# EAGLE design IoT_pro_01 (EAGLE 7.1.0)
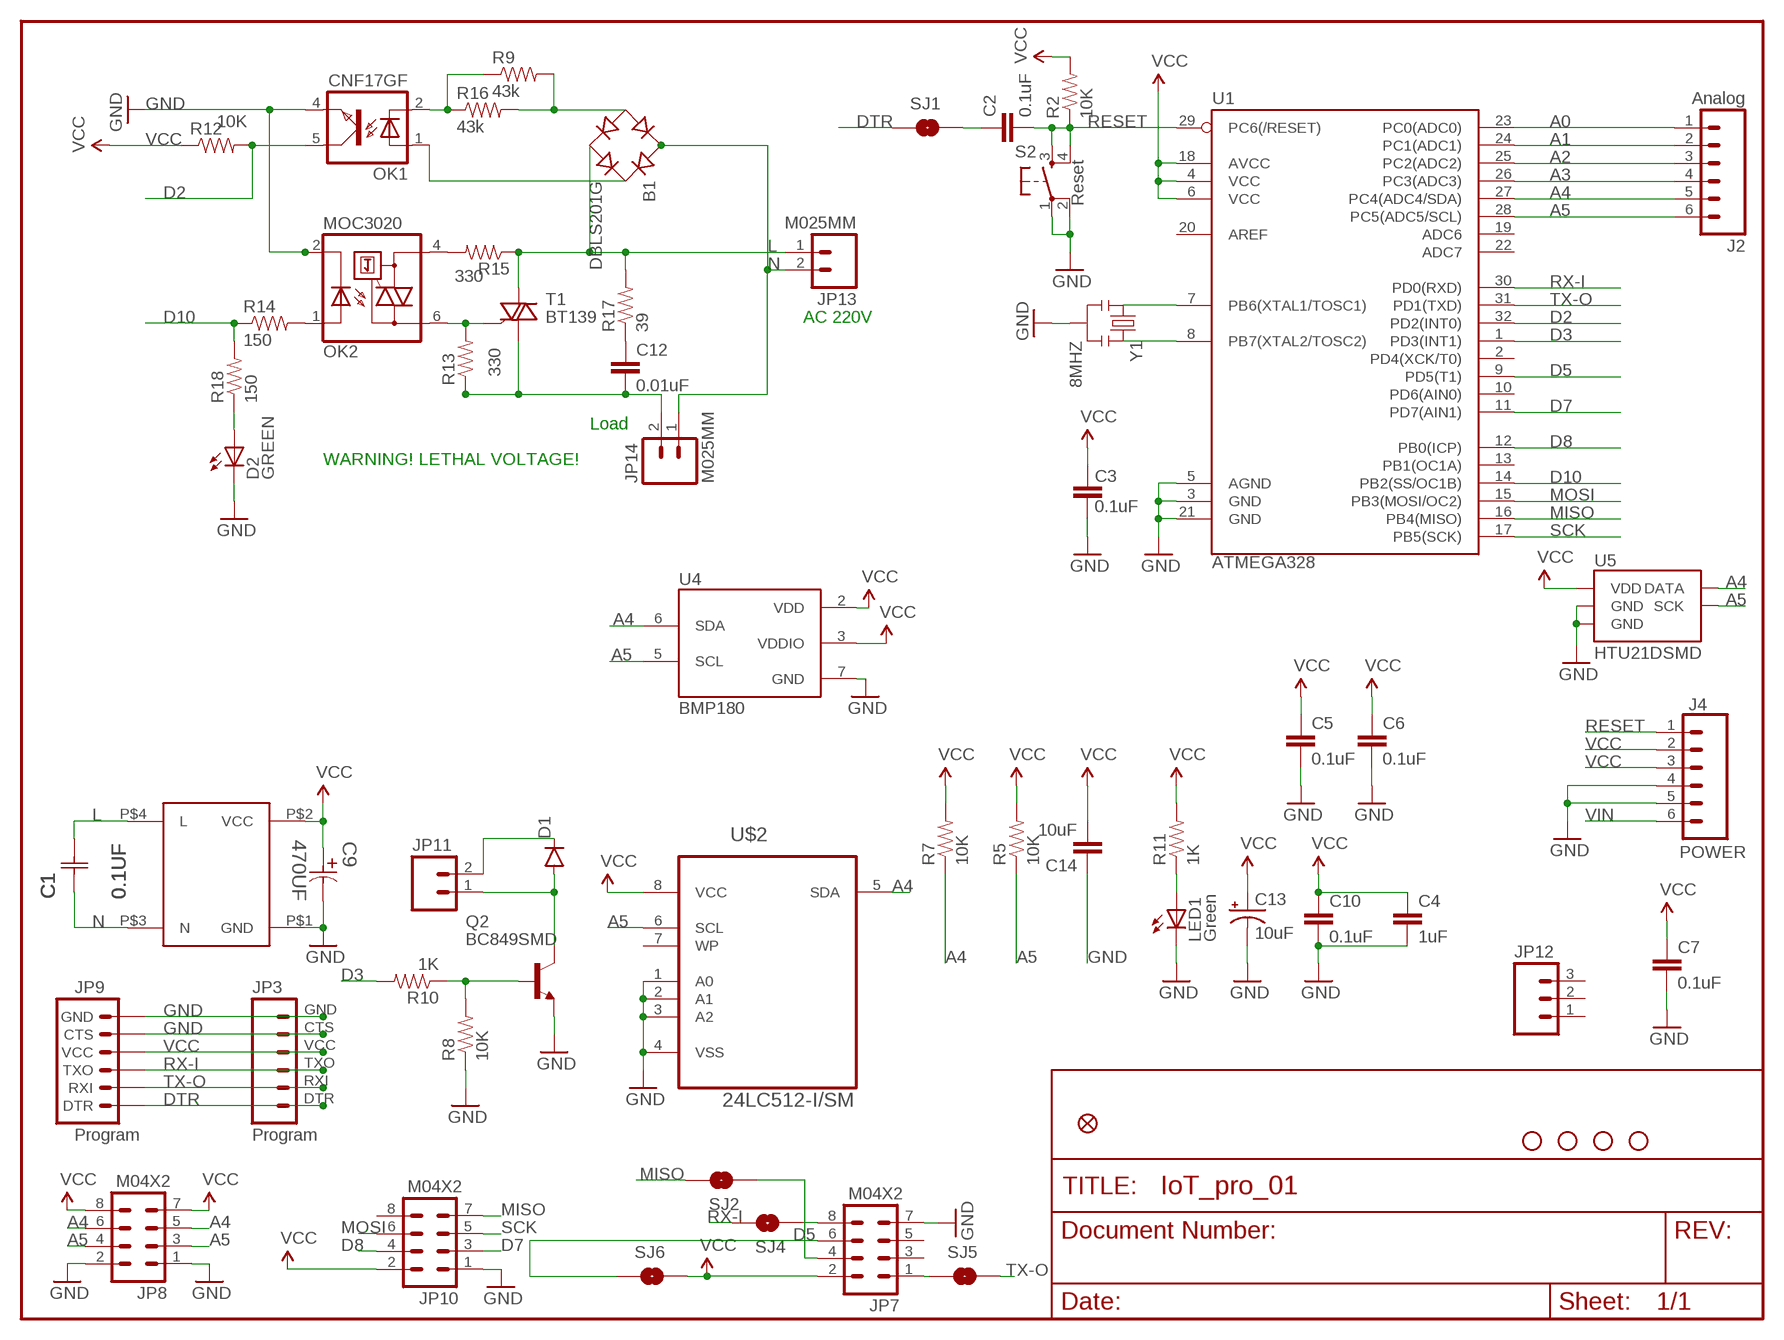
[diagram p0: schematic, sheet 1]

## Parts
B1  DBLS201G  [DBS]
C1  0.1UF  ECQUAAF104M-L17.5-T5  [CAPM1750X500X1250]
C2  0.1uF  CAP0805  [0805]
C3  0.1uF  CAP0805  [0805]
C4  1uF  CAP0805  [0805]
C5  0.1uF  CAP0805  [0805]
C6  0.1uF  CAP0805  [0805]
C7  0.1uF  CAP0805  [0805]
C9  470UF  EEE-FTA471XAP-CASE-D8  [CAPAE660X800N]
C10  0.1uF  CAP0805  [0805]
C12  0.01uF  C-EUC1206  [C1206]
C13  10uF  CAP_POL1206  [EIA3216]
C14  10uF  CAP1206  [1206]
D1  DIODESOD  [SOD-323]
D2  GREEN  LG_T679-E1F1-1  [PLCC2]
J2  Analog  M06SIP  [1X06]
J4  POWER  M06SIP  [1X06]
JP2  FIDUCIAL1X2.5  [FIDUCIAL-1X2.5]
JP3  Program  M06SIP  [1X06]
JP7  M04X2  [2X4]
JP8  M04X2  [2X4]
JP9  Program  ARDUINO_SERIAL_PROGRAMSMD  [1X06-SMD]
JP10  M04X2  [2X4]
JP11  M02PTH  [1X02]
JP12  M03PTH  [1X03]
JP13  M025MM  [SCREWTERMINAL-5MM-2]
JP14  M025MM  [SCREWTERMINAL-5MM-2]
LED1  Green  LG_T679-E1F1-1  [PLCC2]
OK1  CNF17GF  [DIL06B]
OK2  MOC3020  MOC3031S  [DIL6-SMD]
Q2  BC849SMD  [SOT23-BEC]
R2  10K  RESISTOR0805-RES  [0805]
R5  10K  RESISTOR0805-RES  [0805]
R7  10K  RESISTOR0805-RES  [0805]
R8  10K  RESISTOR0805-RES  [0805]
R9  43k  RESISTOR1206  [1206]
R10  1K  RESISTOR0805-RES  [0805]
R11  1K  RESISTOR0805-RES  [0805]
R12  RESISTOR0805-RES  [0805]
R13  RESISTOR1206  [1206]
R14  150  RESISTOR0805-RES  [0805]
R15  RESISTOR1206  [1206]
R16  43k  RESISTOR1206  [1206]
R17  39  RESISTOR1206  [1206]
R18  150  RESISTOR0805-RES  [0805]
S2  Reset  TAC_SWITCHSMD  [TACTILE_SWITCH_SMD]
SJ1  SOLDERJUMPERNC2  [SJ_2S-NOTRACE]
SJ2  SOLDERJUMPERNC2  [SJ_2S-NOTRACE]
SJ4  SOLDERJUMPERNC2  [SJ_2S-NOTRACE]
SJ5  SOLDERJUMPERNC2  [SJ_2S-NOTRACE]
SJ6  SOLDERJUMPERNC2  [SJ_2S-NOTRACE]
T1  BT139  BT136  [TO220AB]
U1  ATMEGA328  ATMEGA168  [TQFP32-08]
U4  BMP180  [BMP180]
U5  HTU21DSMD  [HTU21D]
U$1  STAND-OFFTIGHT  [STAND-OFF-TIGHT]
U$2  24LC512-I/SM  [SOIC127P794X203-8N]
U$3  STAND-OFFTIGHT  [STAND-OFF-TIGHT]
U$4  AC-DCCON  [VTX-214-001-103]
U$9  STAND-OFFTIGHT  [STAND-OFF-TIGHT]
U$10  STAND-OFFTIGHT  [STAND-OFF-TIGHT]
Y1  8MHZ  RESONATOR8MHZ  [RESONATOR-SMD]

## Nets
A0: J2.1 U1.23(PC0(ADC0))
A1: J2.2 U1.24(PC1(ADC1))
A2: J2.3 U1.25(PC2(ADC2))
A3: J2.4 U1.26(PC3(ADC3))
A4: J2.5 JP8.5 JP8.6 R7.1 U1.27(PC4(ADC4/SDA)) U4.6(SDA) U5.DATA U$2.5(SDA)
A5: J2.6 JP8.3 JP8.4 R5.1 U1.28(PC5(ADC5/SCL)) U4.5(SCL) U5.SCK U$2.6(SCL)
D2: OK1.5(COL) R12.2 U1.32(PD2(INT0))
D3: R10.2 U1.1(PD3(INT1))
D5: JP7.6 SJ6.1 U1.9(PD5(T1))
D7: JP10.3 U1.11(PD7(AIN1))
D8: JP10.4 U1.12(PB0(ICP))
D10: R14.1 R18.2 U1.14(PB2(SS/OC1B))
DTR: JP3.DTR JP9.1(DTR) SJ1.1
GND [vcc]: C3.1 C4.2 C5.2 C6.2 C7.2 C9.2 C10.2 C13.C(-) C14.1 D2.C J4.4 J4.5 JP3.CTS JP3.GND JP7.7 JP8.1 JP8.2 JP9.5(CTS) JP9.6(GND) JP10.1 LED1.C OK1.4(EMIT) OK2.2(C) Q2.E R8.1 S2.1 S2.2 U1.3(GND) U1.5(AGND) U1.21(GND) U4.7(GND) U5.7(GND) U5.GND U$2.1(A0) U$2.2(A1) U$2.3(A2) U$2.4(VSS) U$4.P$1(GND) Y1.2
L: B1.AC2 C1.2 JP13.1 R15.1 R17.2 T1.2(A2) U$4.P$4(L)
MISO: JP10.7 SJ2.2 U1.16(PB4(MISO))
MOSI: JP10.6 U1.15(PB3(MOSI/OC2))
N: B1.AC1 C1.1 JP13.2 JP14.1 U$4.P$3(N)
N$1: C2.1 SJ1.2
N$3: U1.7(PB6(XTAL1/TOSC1)) Y1.1
N$4: U1.8(PB7(XTAL2/TOSC2)) Y1.3
N$5: B1.+ OK1.1(A)
N$6: JP7.4 SJ2.1
N$7: OK1.2(C) R9.1 R16.1
N$8: LED1.A R11.1
N$9: B1.- R9.2 R16.2
N$10: JP7.8 SJ4.1
N$11: JP7.1 SJ5.1
N$12: D1.A JP11.1 Q2.C
N$13: D1.C JP11.2
N$14: Q2.B R8.2 R10.1
N$28: C12.2 JP14.2 R13.1 T1.1(A1)
N$29: OK2.6(A2) R13.2 T1.3(G)
N$31: OK2.4(A1) R15.2
N$33: OK2.1(A) R14.2
N$37: C12.1 R17.1
N$38: D2.A R18.1
RESET: C2.2 J4.1 R2.1 S2.3 S2.4 U1.29(PC6(/RESET))
RX-I: JP3.TXO JP9.3(TXO) SJ4.2 U1.30(PD0(RXD))
SCK: JP10.5 U1.17(PB5(SCK))
TX-O: JP3.RXI JP9.2(RXI) SJ5.2 U1.31(PD1(TXD))
VCC: C3.2 C4.1 C5.1 C6.1 C7.1 C9.1 C10.1 C13.A(+) C14.2 J4.2 J4.3 JP3.VCC JP7.2 JP8.7 JP8.8 JP9.4(VCC) JP10.2 R2.2 R5.2 R7.2 R11.2 R12.1 SJ6.2 U1.4(VCC) U1.6(VCC) U1.18(AVCC) U4.2(VDD) U4.3(VDDIO) U5.VDD U$2.8(VCC) U$4.P$2(VCC)
VIN [vcc]: J4.6
Unconnected: JP7.3 JP7.5 JP10.8 JP12.1 JP12.2 JP12.3 U1.2(PD4(XCK/T0)) U1.10(PD6(AIN0)) U1.13(PB1(OC1A)) U1.19(ADC6) U1.20(AREF) U1.22(ADC7) U$2.7(WP)

## Notes on the sheet
- AC 220V
- Load
- WARNING! LETHAL VOLTAGE!

## Library data of the parts
B1 = rectifier:DB?*G: Single Phase 1.0 AMP Glass Passivated Bridge Rectifier Taiwan Semiconductor Co.,Ltd. - TSC Source: http://www.taiwansemi.com/TSCbig5/ezcatfiles/cust/img/img/db101g.pdf http://www.ts.com.tw/db/pictures/modules/PDT/PDT060207001/DBLS201G.pdf
C1 = Panasonic-EEE-EEV-EEF-ECQ:ECQ: Stacked Metallized Plastic Film Capacitor; MPN: ECQUAAF104M; OC_FARNELL: 1907246; OC_NEWARK: 58T1725; RATEDVOLTAGE: 275V; SUPPLIER: PANASONIC; TOLERANCE: ±20%
C2-C7 C10 = SparkFun:CAP: Capacitor Standard 0603 ceramic capacitor, and 0.1" leaded capacitor.
C9 = Panasonic-EEEFT_EEEH:EEE-: Aluminum Electrolytic Capacitors,Surface Mount Type; MPN: EEE-FTA471XAP; OC_FARNELL: 2065963; OC_NEWARK: 73T9142; PACKAGE: CASE-D8; SUPPLIER: PANASONIC; TOLERANCE: ±20 %; VOLTAGERATING: 10V
C12 = rcl:C-EU: CAPACITOR, European symbol
C13 = SparkFun:CAP_POL: Capacitor Polarized These are standard SMD and PTH capacitors. Normally 10uF, 47uF, and 100uF in electrolytic and tantalum varieties. Always verify the external diameter of the through hole cap, it varies with capacity, voltage, and manufacturer. The EIA devices should be standard.
C14 = SparkFun-Capacitors:CAP: Capacitor Standard 0603 ceramic capacitor, and 0.1" leaded capacitor.
D1 = SparkFun-DiscreteSemi:DIODE: Diode These are standard reverse protection diodes and small signal diodes. SMA package can handle up to about 1A. SOD-323 can handle about 200mA. What the SOD-323 package when ordering, there are some mfgs out there that are 5-pin packages.; PROD_ID: DIO-09646
D2 LED1 = led:*_T679-?-1: LC TOPLED® Low Current LED Source: http://catalog.osram-os.com .. LG_LS_LY_T679_OBS.pdf; COLOR: green
J2 J4 = SparkFun:M06: Header 6 Standard 6-pin 0.1" header. Use with straight break away headers (SKU : PRT-00116), right angle break away headers (PRT-00553), swiss pins (PRT-00743), machine pins (PRT-00117), and female headers (PRT-00115). Molex polarized connector foot print use with SKU : PRT-08094 with associated ...
JP2 = abes:FIDUCIAL: Fiducial Alignment Points Various fiducial points for machine vision alignment.
JP3 = SparkFun-Connectors:M06: Header 6 Standard 6-pin 0.1" header. Use with straight break away headers (SKU : PRT-00116), right angle break away headers (PRT-00553), swiss pins (PRT-00743), machine pins (PRT-00117), and female headers (PRT-00115). Molex polarized connector foot print use with SKU : PRT-08094 with associated ...
JP7 JP8 JP10 = SparkFun-Connectors:M04X2: .1" header, two rows of four.
JP9 = SparkFun:ARDUINO_SERIAL_PROGRAM
JP11 = SparkFun-Connectors:M02: Standard 2-pin 0.1" header. Use with - straight break away headers ( PRT-00116) - right angle break away headers (PRT-00553) - swiss pins (PRT-00743) - machine pins (PRT-00117) - female headers (PRT-00115) Molex polarized connector foot print use with: PRT-08233 with associated crimp pins and housings. 2.54_SCREWTERM for use with PRT-10571. 3.5mm Screw Terminal footprints for PRT-08084 5mm Screw Terminal footprints for use with PRT-08432
JP12 = SparkFun-Connectors:M03: Header 3 Standard 3-pin 0.1" header. Use with straight break away headers (SKU : PRT-00116), right angle break away headers (PRT-00553), swiss pins (PRT-00743), machine pins (PRT-00117), and female headers (PRT-00115). Molex polarized connector foot print use with SKU : PRT-08232 with associated crimp pins and housings.
JP13 JP14 = SparkFun-Connectors:M02: Standard 2-pin 0.1" header. Use with - straight break away headers ( PRT-00116) - right angle break away headers (PRT-00553) - swiss pins (PRT-00743) - machine pins (PRT-00117) - female headers (PRT-00115) Molex polarized connector foot print use with: PRT-08233 with associated crimp pins and housings. 2.54_SCREWTERM for use with PRT-10571. 3.5mm Screw Terminal footprints for PRT-08084 5mm Screw Terminal footprints for use with PRT-08432; STOREFRONT_ID: PRT-08432
OK1 = optocoupler:CNF17GF: HEWLETT PACKARD OPTO COUPLER; OC_FARNELL: unknown; OC_NEWARK: unknown
OK2 = optocoupler:MOC30*: 6-Pin DIP Zero-Cross Optoisolators Triac Driver Output (250/400 Volt Peak) Source: Data sheet <http://www.fairchildsemi.com/ds/MO/MOC3031M.pdf> The old path of data sheet not more available 2013-05-06.; MF: FAIRCHILD SEMICONDUCTOR; MPN: MOC3031SM; OC_FARNELL: unknown; OC_NEWARK: 34C1335
Q2 = transistor-npn:BC849*: NPN Transistor
R2 R5 R7 R8 R10 R11 = SparkFun:RESISTOR: Resistor Basic schematic elements and footprints for 0603, 1206, and PTH resistors.
R9 R16 R17 = SparkFun-Resistors:RESISTOR: Resistor Basic schematic elements and footprints for 0603, 1206, and PTH resistors.; K: 45K
R12 = SparkFun-Resistors:RESISTOR: Resistor Basic schematic elements and footprints for 0603, 1206, and PTH resistors.; OHM: 10K
R13-R15 R18 = SparkFun-Resistors:RESISTOR: Resistor Basic schematic elements and footprints for 0603, 1206, and PTH resistors.; OHM: 330
S2 = SparkFun:TAC_SWITCH: Momentary Switch Button commonly used for reset or general input. Spark Fun Electronics SKU : COM-00097
SJ1 SJ2 SJ4-SJ6 = SparkFun:SOLDERJUMPER: Solder Jumper Standard SMD solder jumper. Used to automate production. Two varients : Normally Open and Normally Closed are the same, but have different paste layers. NC will have a large amount of paste and should jumper during reflow.
T1 = triac:BT136: Triac BT136 series E sensitive gate Source: http://www.nxp.com/acrobat_download/datasheets/BT136_SERIES_E_2.pdf
U1 = SparkFun:ATMEGA168
U4 = SparkFun-Sensors:BMP180: BOSCH BMP180 DIGITAL BAROMETRIC PRESSURE SENSOR Web page: http://www.bosch-sensortec.com/en/homepage/products_3/environmental_sensors_1/bmp180_1/bmp180 Datasheet: http://ae-bst.resource.bosch.com/media/products/dokumente/bmp180/BST-BMP180-DS000-09.pdf The BMP180 is the function compatible successor of the BMP085, a new generation of high precision digital pressure sensors for consumer applications. The ultra-low power, low voltage electronics of the BMP180 is optimized for use in mobile phones, PDAs, GPS navigation devices and outdoor equipment. With a low altitude noise of merely 0.25m at fast conversion time, the BMP180 offers superior performance. The I2C interface allows for easy system integration with a microcontroller. The BMP180 is based on piezo-resistive technology for EMC robustness, high accuracy and linearity as well as long term stability. Key features: - Temperature measurement included - I2C interface - Fully calibrated - Pb-free, halogen-free and RoHS compliant, - MSL 1 Basic specs: Pressure range: 300 to 1100hPa (+9000m to -500m relating to sea level) Supply voltage: 1.8 to 3.6V (VDD), 1.62V to 3.6V (VDDIO) Package: LGA package with metal lid Small footprint: 3.6mm x 3.8mm Super-flat: 0.93mm height Low power: 5μA at 1 sample / sec. in standard mode Low noise: 0.06hPa (0.5m) in ultra low power mode, 0.02hPa (0.17m) advanced resolution mode Typical applications: - Enhancement of GPS navigation (dead-reckoning, slope detection, etc.) - In- and out-door navigation - Leisure and sports - Weather forecast - Vertical velocity indication (rise/sink speed)
U5 = SparkFun-Sensors:HTU21D
U$1 U$3 U$9 U$10 = SparkFun-Electromechanical:STAND-OFF: #4 Stand Off This is the mechanical footprint for a #4 phillips button head screw. Use the keepout ring to avoid running the screw head into surrounding components. SKU : PRT-00447
U$2 = 24LC512-I:24LC512-I/SM: 512K I2C Serial EEPROM; MPN: 24LC512-I/SM; OC_FARNELL: 9758038; OC_NEWARK: 62K0582; PACKAGE: SOIC-8; SUPPLIER: MICROCHIP
U$4 = mojaknižnica:AC-DCCON
Y1 = SparkFun-FreqCtrl:RESONATOR: Resonator Small SMD resonator. Used, eg, on the Arduino Pro/ Pro Mini boards. 8MHz- XTAL-08895 16MHz- XTAL-08900; PROD_ID: XTAL-08895

## Net classes
0 default: width 0.203 mm
1 vcc: width 0.254 mm

## Board
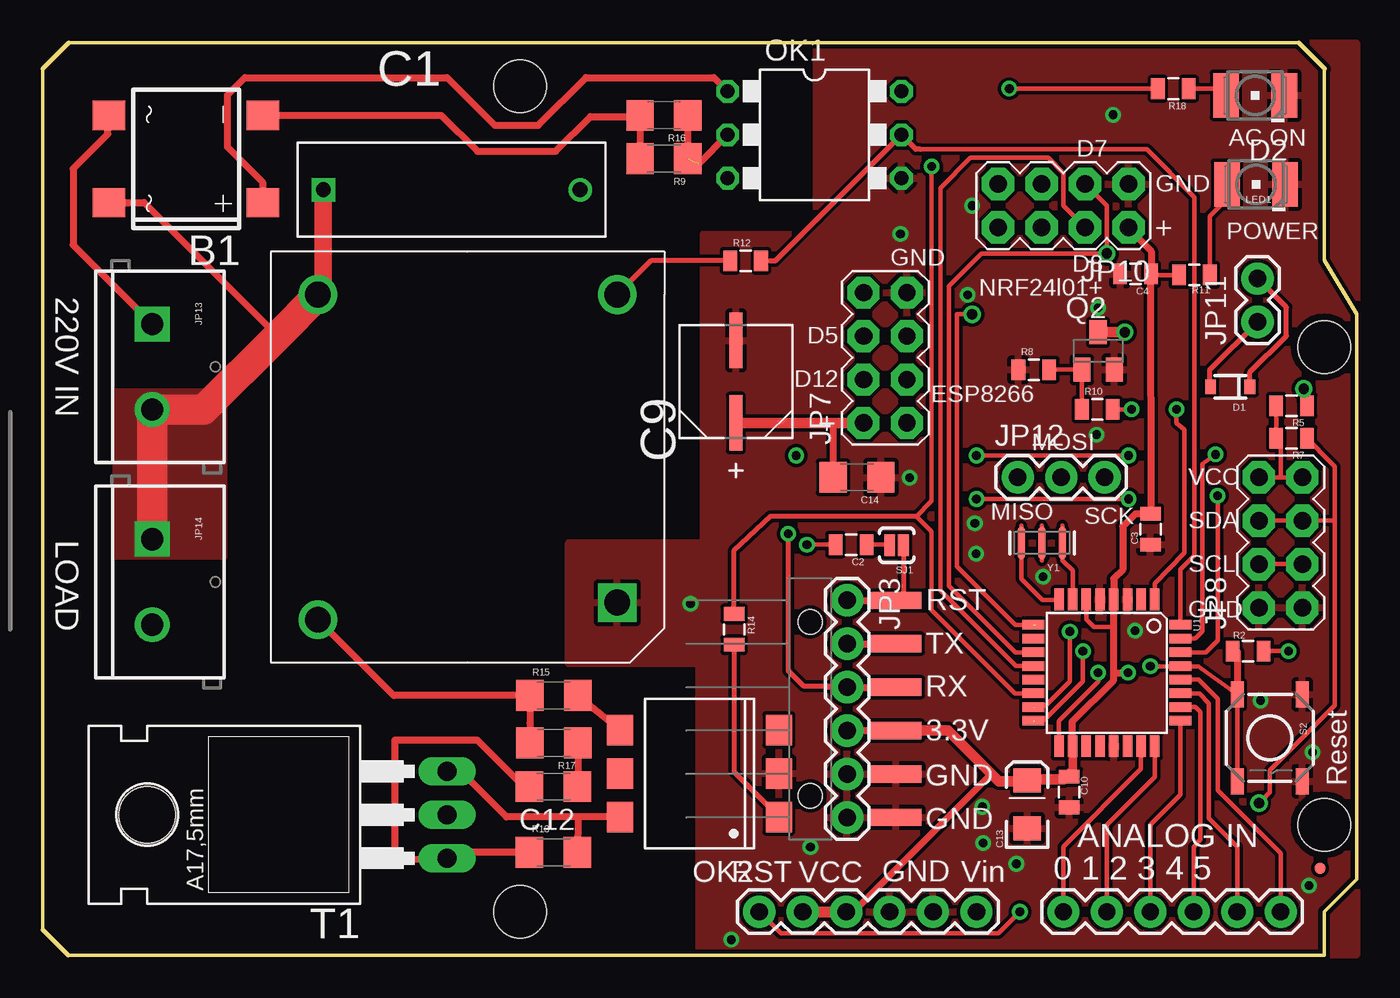
[diagram p1: board, top side]
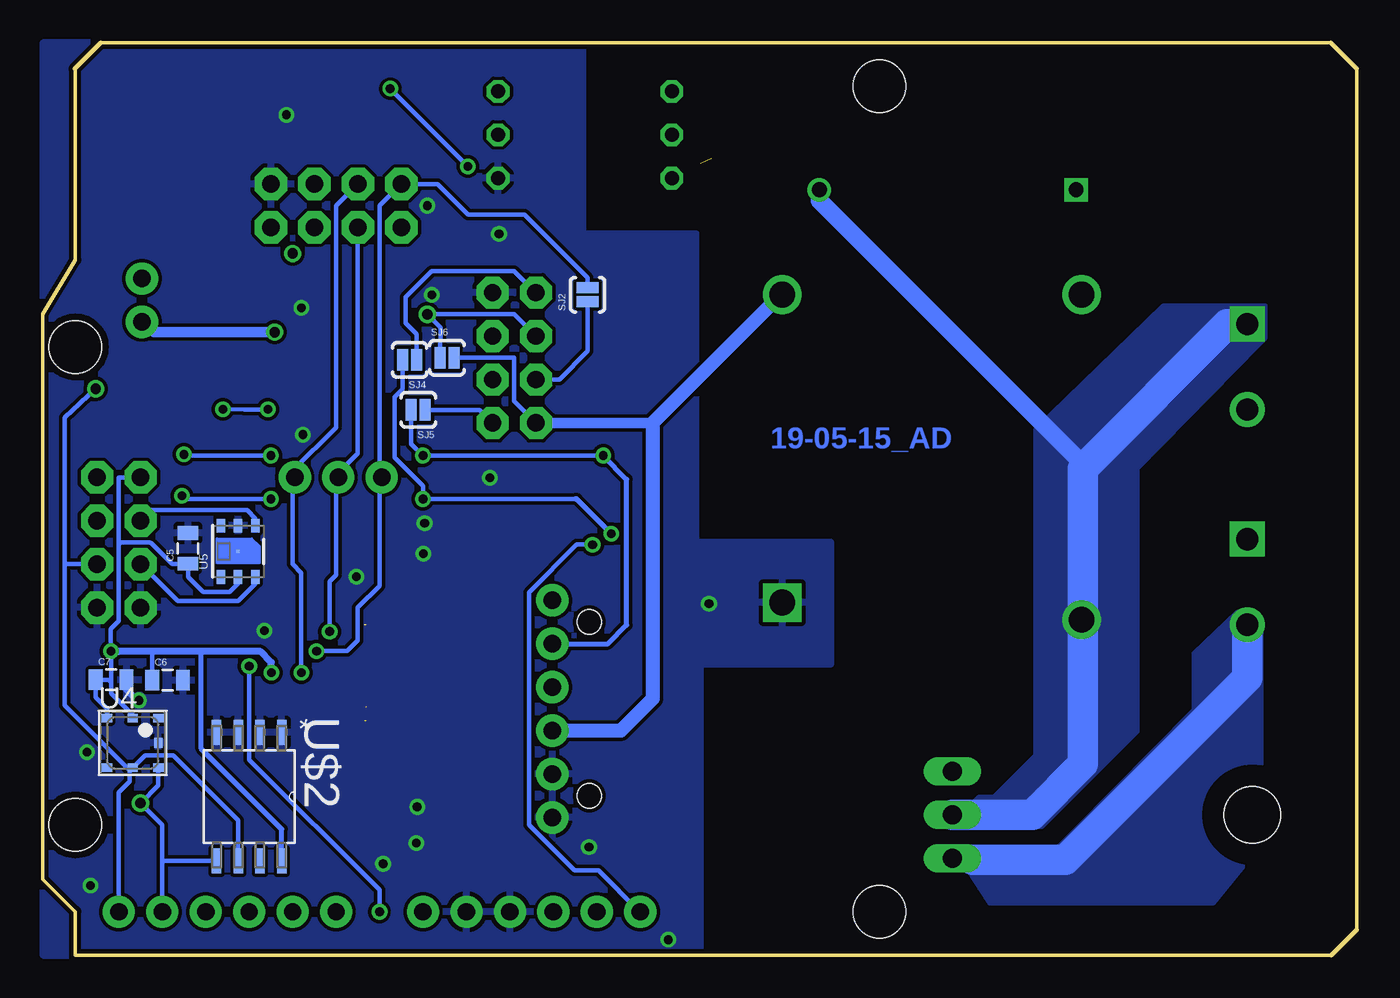
[diagram p2: board, bottom side, seen from below]

Size 76.8 x 53.34 mm. Coordinates in mm from the lower left corner, seen from the top.
Outline: 74.89,51.82 74.89,40.64 76.8,37.47 76.8,4.45 74.89,2.54 74.89,0 1.5,0 0,1.5 0,51.82 1.52,53.34 73.41,53.34 74.93,51.82
Copper layers (1*16): Top 0.035mm / dielectric 1.5mm / Bottom 0.035mm
Design rules "default *": minimum track width 10mil, minimum drill 24mil, track to track 8mil, track to pad 8mil, pad to pad 8mil, via to via 8mil, smd to smd 8mil, copper to edge 10mil, drill to drill 8mil, minimum pad ring 10mil, minimum via ring 8mil, stop-mask expansion 4mil, vias tented up to drill 0mil, thermal gap 10mil

### Footprints (pad centres in the part's own frame; a part is rotated, then mirrored left to right if it is on the bottom)
DBS = smd 1.7 x 1.9: + -2.55,-4.5; - 2.55,-4.5; AC1 -2.55,4.5; AC2 2.55,4.5
CAPM1750X500X1250 = drill 0.864 square: 1 -15.011,0 | drill 0.864: 2 0,0
0805 = smd 0.8 x 1.2: 1 -0.9,0; 2 0.9,0
CAPAE660X800N = smd 3.251 x 0.762: 1 -2.413,0; 2 2.413,0
C1206 = smd 1.6 x 1.8: 1 -1.4,0; 2 1.4,0
EIA3216 = smd 1.4 x 1.6: A 1.4,0; C -1.4,0
1206 = smd 1.6 x 1.8: 1 -1.4,0; 2 1.4,0
SOD-323 = smd 0.63 x 0.83: A 1.15,0; C -1.15,0
PLCC2 = smd 2.6 x 1.5: A 0,1.7; C 0,-1.7
1X06 = drill 1.016 pad 1.88: 1 0,0; 2 2.54,0; 3 5.08,0; 4 7.62,0; 5 10.16,0; 6 12.7,0
FIDUCIAL-1X2.5 = smd 0.635 x 0.635: 1 0,0
1X06' = drill 1.016 pad 1.88: CTS 10.16,0; DTR 0,0; GND 12.7,0; RXI 2.54,0; TXO 5.08,0; VCC 7.62,0
2X4 = drill 1.016 pad 1.88 octagon: 1 -3.81,-1.27; 2 -3.81,1.27; 3 -1.27,-1.27; 4 -1.27,1.27; 5 1.27,-1.27; 6 1.27,1.27; 7 3.81,-1.27; 8 3.81,1.27
1X06-SMD = smd 1 x 3: 1 -6.35,5; 2 -3.81,5; 3 -1.27,5; 4 1.27,5; 5 3.81,5; 6 6.35,5 | hole 1.4: -5.08,0; 5.08,0
1X02 = drill 1.016 pad 1.88: 1 0,0; 2 2.54,0
1X03 = drill 1.016 pad 1.88: 1 0,0; 2 2.54,0; 3 5.08,0
SCREWTERMINAL-5MM-2 = drill 1.3 pad 2.032 square: 1 0,0 | drill 1.3 pad 2.032: 2 5,0
DIL06B = drill 0.813 octagon: 1 -2.54,-5.08; 2 0,-5.08; 3 2.54,-5.08; 4 2.54,5.08; 5 0,5.08; 6 -2.54,5.08
DIL6-SMD = smd 1.78 x 1.52: 1 -2.54,-4.645; 2 0,-4.645; 3 2.54,-4.645; 4 2.54,4.645; 5 0,4.645; 6 -2.54,4.645
SOT23-BEC = smd 1 x 1.4: B -0.95,-1.1; C 0,1.1; E 0.95,-1.1
TACTILE_SWITCH_SMD = smd 1.524 x 0.762: 1 -2.54,1.905; 2 2.54,1.905; 3 -2.54,-1.905; 4 2.54,-1.905
SJ_2S-NOTRACE = smd 0.635 x 1.27: 1 -0.401,0; 2 0.413,0
TO220AB = drill 1.118 long: 1 -2.54,-6.35; 2 0,-6.35; 3 2.54,-6.35 | hole 3.302: 0,11.176
TQFP32-08 = smd 1.27 x 0.559: 1 -4.293,2.8; 2 -4.293,2; 3 -4.293,1.2; 4 -4.293,0.4; 5 -4.293,-0.4; 6 -4.293,-1.2; 7 -4.293,-2; 8 -4.293,-2.8; 17 4.293,-2.8; 18 4.293,-2; 19 4.293,-1.2; 20 4.293,-0.4; 21 4.293,0.4; 22 4.293,1.2; 23 4.293,2; 24 4.293,2.8 | smd 0.559 x 1.27: 9 -2.8,-4.293; 10 -2,-4.293; 11 -1.2,-4.293; 12 -0.4,-4.293; 13 0.4,-4.293; 14 1.2,-4.293; 15 2,-4.293; 16 2.8,-4.293; 25 2.8,4.293; 26 2,4.293; 27 1.2,4.293; 28 0.4,4.293; 29 -0.4,4.293; 30 -1.2,4.293; 31 -2,4.293; 32 -2.8,4.293
BMP180 = smd 0.6 x 0.5: 1 1.5,1.45; 2 0,1.45; 3 -1.5,1.45; 4 -1.5,-1.45; 5 0,-1.45; 6 1.5,-1.45 | smd 0.5 x 0.6: 7 1.5,0
HTU21D = smd 0.2 x 0.2: 7 0,0 | smd 0.8 x 0.5: DATA 1.5,-1; GND 1.5,0; NC@1 -1.5,1; NC@6 1.5,1; SCK -1.5,-1; VDD -1.5,0
STAND-OFF-TIGHT = hole 3.048: 0,0
SOIC127P794X203-8N = smd 1.473 x 0.559: 1 -3.759,1.905; 2 -3.759,0.635; 3 -3.759,-0.635; 4 -3.759,-1.905; 5 3.759,-1.905; 6 3.759,-0.635; 7 3.759,0.635; 8 3.759,1.905
VTX-214-001-103 = drill 1.5 square: P$1 20.75,3 | drill 1.5: P$2 20.75,21; P$3 3.25,21; P$4 3.25,2
RESONATOR-SMD = smd 0.45 x 1.905: 1 -1.2,0; 2 0,0; 3 1.2,0

### Placement (x,y rotation side)
B1  8.38,46.54 90 top
C1  31.41,44.75 0 top
C2  47.25,24.01 180 top
C3  64.75,24.91 90 top
C4  63.87,39.83 180 top
C5  68.3,23.78 90 bottom
C6  69.5,16.08 0 bottom
C7  72.8,16.11 0 bottom
C9  40.51,33.53 90 top
C10  60,9.54 270 top
C12  29.84,9.86 180 top
C13  57.54,8.81 90 top
C14  47.59,27.94 180 top
D1  69.41,33.23 180 top
D2  70.86,50.26 90 top
J2  59.66,2.54 0 top
J4  41.88,2.54 0 top
JP2  74.64,5.08 90 top
JP3  Program  [1X06']  47.02,20.75 270 top
JP7  49.24,34.92 90 top
JP8  72.36,24.13 90 top
JP9  44.86,14.4 270 top
JP10  59.66,43.81 180 top
JP11  71,37.02 90 top
JP12  56.99,27.94 0 top
JP13  6.39,36.9 270 top
JP14  6.39,24.32 270 top
LED1  70.92,45.06 90 top
OK1  45.11,47.96 270 top
OK2  38.38,10.62 90 top
Q2  61.68,35.32 0 top
R2  70.45,17.78 0 top
R5  72.99,32.13 180 top
R7  72.99,30.23 180 top
R8  57.93,34.23 0 top
R9  36.31,46.56 180 top
R10  61.64,31.91 0 top
R11  67.31,39.77 180 top
R12  41.08,40.59 0 top
R13  29.84,6.02 0 top
R14  40.4,19.05 270 top
R15  29.87,15.18 0 top
R16  36.31,49.1 180 top
R17  29.88,12.41 180 top
R18  66.07,50.66 180 top
S2  71.72,12.7 270 top
SJ1  49.91,23.97 180 top
SJ2  44.96,38.61 90 bottom
SJ4  55.36,34.8 180 bottom
SJ5  54.85,31.88 180 bottom
SJ6  53.18,34.92 0 bottom
T1  17.28,8.21 90 top
U1  62.2,16.51 270 top
U4  71.54,12.42 0 bottom
U5  65.38,23.61 90 bottom
U$1  27.91,50.8 0 top
U$2  64.73,9.27 270 bottom
U$3  27.91,2.54 0 top
U$4  12.83,17.62 0 top
U$9  74.89,35.56 0 top
U$10  74.89,7.62 0 top
Y1  58.4,24.11 180 top

### Tracks (layer width: path | path; a pad name or v marks a point on that pad's centre or on a via)
A0
  Top 0.254: U1.23 64.19,10.89 59.66,6.35 | J2.1 59.66,6.35 | 59.66,6.31 59.66,6.35
A1
  Top 0.254: U1.24 65,10.42 62.2,7.62 J2.2
A2
  Top 0.254: U1.25 66.49,9.37 64.73,7.62 64.73,2.79 64.86,2.67 J2.3
A3
  Top 0.254: U1.26 67.37,14.51 67.66,14.22 67.66,6.73 67.28,6.35 J2.4
A4  (via drill 0.6)
  Top 0.254: U1.27 67.59,15.31 68.16,14.73 68.16,8 69.81,6.35 J2.5 | R7.1 73.64,30.46 75.53,28.57 75.53,25.4 | 75.53,25.4 JP8.5 JP8.6 | 75.53,25.4 75.53,14.61 71.72,10.79 71.72,9.53 v71.08,8.89
  Bottom 0.254: 69.81,5.46 69.81,7.62 v71.08,8.89 70.04,9.93 U4.6 | 69.81,5.46 J2.5 | U5.DATA 64.38,25.54 64.87,26.02 70.46,26.02 JP8.6 | U$2.5 69.76,5.51 69.81,5.46
A5  (via drill 0.6)
  Top 0.254: U1.28 67.55,16.11 68.67,14.99 68.67,9.65 72.36,5.97 J2.6 | 73.62,32.38 R5.1 73.9,32.39 73.9,33.03 73.71,33.1 v73.71,33.12 | JP8.4 JP8.3
  Bottom 0.254: JP8.3 75.53,22.86 | 75.53,22.86 75.53,14.61 71.72,10.79 | J2.6 72.36,9.53 71.72,10.16 71.72,10.79 | 75.53,22.86 75.53,31.42 v73.71,33.12 | JP8.4 68.92,20.7 65.39,20.7 64.38,21.71 U5.SCK | 71.72,10.79 U4.5 70.82,11.68 69.18,11.68 65.37,7.87 U$2.6
D2
  Top 0.254: U1.32 66.49,22.54 67.31,23.37 67.31,44.32 64.52,47.12 51.31,47.12
  Top 0.305: 51.31,47.12 51.03,47.12 OK1.5 42.82,40.59 R12.2
D3  (via drill 0.5)
  Top 0.254: v66.26,31.92 66.26,31.11 66.72,30.73 66.72,23.53 66.72,23.5 65,21.72 U1.1 | R10.2 v63.65,31.91
  Bottom 0.254: v66.26,31.92 65.02,31.91 v63.65,31.91
D5  (via drill 0.6)  (1 unrouted)
  Top 0.254: 58,19.3 56.86,19.3 53.43,22.73 53.43,37.47 v54.32,37.47
  Bottom 0.254: JP7.6 49.24,37.47 v54.32,37.47 53.56,36.7 SJ6.1
D7  (via drill 0.6)
  Top 0.254: U1.11 56.84,17.71 52.96,21.59 52.96,39.12 54.87,41.02 v62.2,41.02 62.2,43.81 JP10.3
D8
  Top 0.254: JP10.4 59.66,43.81 59.66,45.72 58.77,46.61 54.23,46.61 52.45,44.83 52.45,21.34 56.88,16.91 U1.12
D10  (via drill 0.5)
  Top 0.254: U1.14 56.83,15.31 51.95,20.19 51.95,24.77 51.82,24.89 51.05,25.65 51.94,26.54 v51.94,46.1 | R18.2 v56.5,50.66 | 40.39,19.97 R14.1
  Top 0.305: 51.05,25.65 42.55,25.65 40.39,23.62 40.39,19.97
  Bottom 0.254: v56.5,50.66 v51.94,46.1
DTR
  Top 0.254: 47.02,20.88 46.94,20.8 JP9.1 | 48.9,20.8 JP9.1 | 49.04,20.95 JP9.1
  Top 0.305: SJ1.1 50.31,21.2 JP9.1
  Top 0.406: JP3.DTR JP9.1
GND  (via drill 0.51)
  Bottom 0.406: v71.18,14.89 71.27,14.89 71.91,15.54 C7.2
  other vias: 58.47,22.13 50.67,27.92 61.69,37.85 74.01,4.06 63.85,18.97 54.92,8.67 54.48,25.26 56.9,5.34 54.97,6.55 62.56,49.13 74.21,11.87 44.87,6.32 37.86,20.55 40.24,0.91 54.55,23.47 61.6,30.43 54.32,43.81 54.07,38.61 50.13,42.16
  pour Top: 38.61,42.16 45.21,42.16 45.21,53.34 76.8,53.34 76.8,0 38.35,0 38.35,17.02 30.73,17.02 30.73,24.13 38.61,24.13
  pour Bottom: 38.61,42.16 45.21,42.16 45.21,53.34 76.8,53.34 76.8,0 38.35,0 38.35,17.02 30.73,17.02 30.73,24.13 38.61,24.13
L
  Top 0.406: B1.AC2 4.26,48.71 | 4.26,48.71 4.39,48.59 | JP13.1 1.78,41.51 1.78,45.97 3.81,48.01 3.81,48.26 4.26,48.71 | U$4.P$4 20.51,15.18 R15.1 28.47,13.56 R17.2
  Bottom 1.016: 16,28.45 15.88,28.57 31.41,44.11 C1.2 | 16,19.69 U$4.P$4 16,19.54
  Bottom 1.778: JP13.1 7.55,36.9 15.88,28.57 | 16,28.45 16,19.69 | T1.2 18.96,8.21 16,11.18 16,19.54
  pour Bottom (no thermals): 5.33,37.97 11.3,37.97 18.8,30.73 18.8,11.68 21.21,9.27 22.1,9.27 22.61,8.76 22.61,8.13 21.97,7.49 18.41,7.49 12.83,13.08 12.83,28.45 5.71,35.69 5.33,36.07
MISO  (via drill 0.51)  (1 unrouted)
  Top 0.254: 58,13.71 58,13.72 58.51,13.72 60.8,16 v60.8,17.78
  Bottom 0.254: v60.8,17.78 59.02,17.78 58.38,18.41 58.38,20.32 57.12,21.59 57.12,43.81 JP10.7 53.72,45.09 51.94,43.31 48.64,43.31 44.96,39.62 SJ2.2
MOSI  (via drill 0.51)  (1 unrouted)
  Top 0.254: 57.93,14.48 58,14.48 | v60.04,18.92 60.04,16 58.64,14.61 58.13,14.61 58,14.48 | 57.97,14.51 58,14.48
  Bottom 0.254: v60.04,18.92 60.04,21.84 59.66,22.23 59.66,28.07 58.38,29.34 JP10.6
N
  Top 0.406: B1.AC1 5.92,43.99 13.72,36.2
  Top 1.016: C1.1 16.4,38.94 U$4.P$3 16.08,38.55
  Top 1.778: JP14.1 JP13.2 9.42,31.9 13.72,36.2 16.08,38.55
  pour Top (no thermals): 4.19,23.24 10.67,23.24 10.67,33.02 4.19,33.02
N$1
  Top 0.254: C2.1 49.33,24.01 SJ1.2
N$3
  Top 0.254: U1.7 60.2,22.5 59.6,23.09
N$4
  Top 0.254: U1.8 59.37,20.78 58.43,20.78 57.21,22 57.21,23.09 57.2,23.09
N$5
  Top 0.406: OK1.1 39.22,51.31 31.75,51.31 28.96,48.51 26.42,48.51 23.62,51.31 11.81,51.31 10.79,50.29 10.79,47.24 12.88,45.16 B1.+
N$6
  Bottom 0.254: JP7.4 46.61,33.66 44.96,35.31 SJ2.1
N$7  (1 unrouted)
  Top 0.406: R9.1 R16.1 | 38.34,46.28 OK1.2
N$8
  Top 0.254: R11.1 68.21,43.2 69.22,44.2 69.22,46.07 LED1.A
N$9
  Top 0.406: B1.- 23.3,49.09 25.4,46.99 29.97,46.99 32,49.02 34.83,49.02 R16.2 R9.2
N$10
  Bottom 0.254: SJ4.1 54.96,36.32 55.59,36.96 55.59,38.48 54.07,40.01 49.24,40.01 JP7.8
N$11
  Bottom 0.254: SJ5.1 51.27,31.88 JP7.1
N$12  (via drill 0.6)
  Top 0.254: Q2.C 61.72,36.42
  Top 0.305: D1.A 68.23,33.36 68.22,33.23 68.22,34.24 JP11.1
  Top 0.61: 61.72,36.42 v63.24,36.42
  Bottom 0.254: v63.24,36.42 63.24,36.43
  Bottom 0.61: 63.24,36.43 68.16,36.43 69.82,36.43 70.28,36.43 JP11.1
N$13
  Top 0.305: D1.C 70.56,34.08 72.69,36.21 72.69,37.88 JP11.2
N$14
  Top 0.254: R8.2 Q2.B R10.1
N$15  (via drill 0.6)
  other vias: 63.25,36.43
N$17
  pour Top: 68.42,3.05 68.67,3.05 68.67,2.03 68.42,2.03
N$18
  pour Bottom: 68.42,3.05 68.67,3.05 68.67,2.03 68.42,2.03
N$22
  pour Bottom: 58.13,28.32 58.38,28.32 58.38,27.56 58.13,27.56
N$23
  pour Bottom: 60.67,28.32 60.92,28.32 60.92,27.56 60.67,27.56
N$28
  Top 0.406: R13.1 23.8,6.02 24,5.97 23.67,5.71 T1.1 23.58,5.62 22.88,5.62 20.57,5.63 20.57,12.57 25.4,12.57 28.06,9.91 C12.2
  Bottom 1.016: 22.45,5.59 T1.1
  Bottom 1.778: JP14.2 6.39,16.21 17.02,5.59 22.45,5.59
  pour Bottom (no thermals): 5.59,19.56 5.59,6.48 8.38,3.05 21.46,3.05 22.73,4.95 18.8,4.95 9.53,14.35 9.53,17.65 6.99,20.07 6.1,20.07
N$29
  Top 0.406: OK2.6 31.27,8.08 | 31.27,8.08 R13.2 | 31.27,8.08 27.1,8.08 24.77,10.41 23.97,10.41 T1.3
N$31
  Top 0.406: R15.2 31.57,14.93 OK2.4
N$33
  Top 0.305: R14.2 40.4,10.7 OK2.1
N$37
  Top 0.406: R17.1 31.28,10.33 C12.1
N$38
  Top 0.254: R18.1 68.92,50.66 D2.A
RESET  (via drill 0.51)
  Top 0.254: J4.1 43.15,1.27 55.84,1.27 v57.12,2.54 | v64.73,16.89 66.39,16.89 66.41,16.91 U1.29 66.62,16.91 66.64,16.89 67.53,16.89 S2.3 S2.4 | C2.2 v44.67,24.01 v44.67,24
  Top 0.406: R2.1 69.81,17.78 S2.3
  Bottom 0.254: v64.73,16.89 64.73,11.43 57.12,3.81 v57.12,2.54 | J4.1 41.91,2.54 44.32,4.95 45.72,4.95 48.39,7.62 48.39,21.21 45.59,24.01 v44.67,24.01 v44.67,24
RX-I  (via drill 0.5, 0.51)
  Top 0.254: U1.30 67.97,17.71 68.67,18.41 v68.67,26.86 | v54.58,26.67 v63.47,26.67 | 45.74,15.66 JP3.TXO
  Top 0.305: v43.56,24.64 43.56,16.64 44.45,15.75 46.94,15.75 JP3.TXO
  Top 0.406: JP3.TXO JP9.3
  Bottom 0.254: v68.67,26.86 68.42,26.67 v63.47,26.67 | 45.69,26.67 v54.58,26.67 54.58,27.43 56.23,29.08 56.23,32.64 55.77,33.09 SJ4.2
  Bottom 0.305: 45.69,26.67 45.59,26.67 v43.56,24.64
SCK  (via drill 0.51)
  Top 0.254: v61.69,16.51 61.69,16 59.4,13.71 U1.17
  Bottom 0.254: JP10.5 59.66,43.81 59.66,30.86 62.2,28.32 62.2,22.86 61.69,22.35 v61.69,16.51
TX-O  (via drill 0.51)
  Top 0.254: U1.31 67.37,18.51 67.78,18.92 67.78,28.7 v68.55,29.27 | v54.58,29.21 v63.47,29.21
  Top 0.406: JP3.RXI JP9.2
  Bottom 0.254: v68.55,29.27 68.29,29.21 v63.47,29.21 | v44.03,29.21 v54.58,29.21 55.26,29.9 SJ5.2
  Bottom 0.305: v44.03,29.21 44.03,29.18 42.67,27.81 42.67,19.3 43.77,18.21 JP3.RXI
VCC  (via drill 0.51)
  Top 0.254: 59.66,10.29 C10.1 | U1.18 60.19,12.22 | 62.6,20.9 U1.4 | U1.6 60.99,19.61 61.43,19.18 62.6,19.18 | R2.2 v72.82,17.78 | JP8.8 72.36,27.94 | 72.36,27.94 JP8.7 | R5.2 R7.2 72.36,30.48 72.36,27.94 | 46.19,27.95 C14.2 46.19,27.95 | R11.2 64.83,39.77 C4.1
  Top 0.305: R12.1 35.55,40.59 U$4.P$2
  Top 0.406: 60.19,12.22 60.18,13.66 62.59,16.07 62.6,16.51 | 62.6,16.51 62.6,19.18 U1.4 | 62.6,16.51 v63.44,16.51 | JP3.VCC JP9.4 | JP10.2 63.47,42.52 64.78,41.15 64.78,40.33 C4.1 64.73,39.37 64.76,25.91 C3.2 63.87,25.8 63.13,25.06 63.13,22.52 62.6,22.02 62.6,20.83 U1.4 | 47.72,31.11 46.19,31.11 46.19,27.95 | J4.3 47.37,2.54 55.44,10.6
  Top 0.508: U1.18 60.2,10.83 59.66,10.29
  Top 0.61: 57.24,10.29 59.66,10.29 | 57.28,10.27 C13.A 57.48,10.16 55.88,10.16 55.44,10.6 52.91,13.13 JP9.4 | C9.1 47.72,31.11 JP7.2
  Top 0.635: 57.12,10.29 C13.A 57.24,10.29 | J4.2 J4.3
  Bottom 0.254: 72.38,17.75 v72.82,17.78 | JP8.8 72.36,27.94 72.36,24.02 | 72.36,24.02 72.36,19.53 72.82,19.06 v72.82,17.78 | 72.36,24.02 72.24,24.13 70.53,24.13 70.5,24.1 70.47,24.1 69.25,22.88 C5.1 68.31,22.11 67.42,21.22 65.88,21.22 65.38,21.72 U5.VDD | U4.2 71.54,14.06 72.8,15.32 72.8,15.96 | 72.8,15.96 72.8,17.76 v72.82,17.78 | 72.8,15.96 72.95,16.11 C7.1 73.71,16.09 73.71,15.06 73.04,14.39 U4.3 | C6.1 70.4,17.68 70.48,17.75 | SJ6.2 49.24,34.92 49.24,32.38 JP7.2
  Bottom 0.305: U$2.8 62.83,7.37 67.53,12.06 67.53,17.75
  Bottom 0.406: v63.44,16.51 63.44,17.12 64.08,17.75 67.53,17.75 70.48,17.75 72.38,17.75
  Bottom 0.61: 41.15,31.11 JP7.2
  Bottom 0.813: U$4.P$2 33.65,38.62 41.15,31.11 41.15,14.99 43,13.13 JP3.VCC

### Text on the board
Bottom: 19-05-15_AD
tPlace: D7 | AC ON | GND | + | POWER | GND | D8 | NRF24l01+ | 220V IN | D5 | D12 | ESP8266 | + | MOSI | VCC | MISO | SCK | SDA | LOAD | SCL | RST | GND | TX | RX | 3.3V | GND | Reset | GND | Vin | ANALOG IN | RST | VCC | GND | 0 1 2 3 4 5
tValues: DNP | DNP | JST-Right Angle | DNP | Production: DNP | Production: DNP | Proto: 2x3 male header up | DNP | DNP | DNP